# EAGLE design AS726x_Breakout (EAGLE 7.7.0)
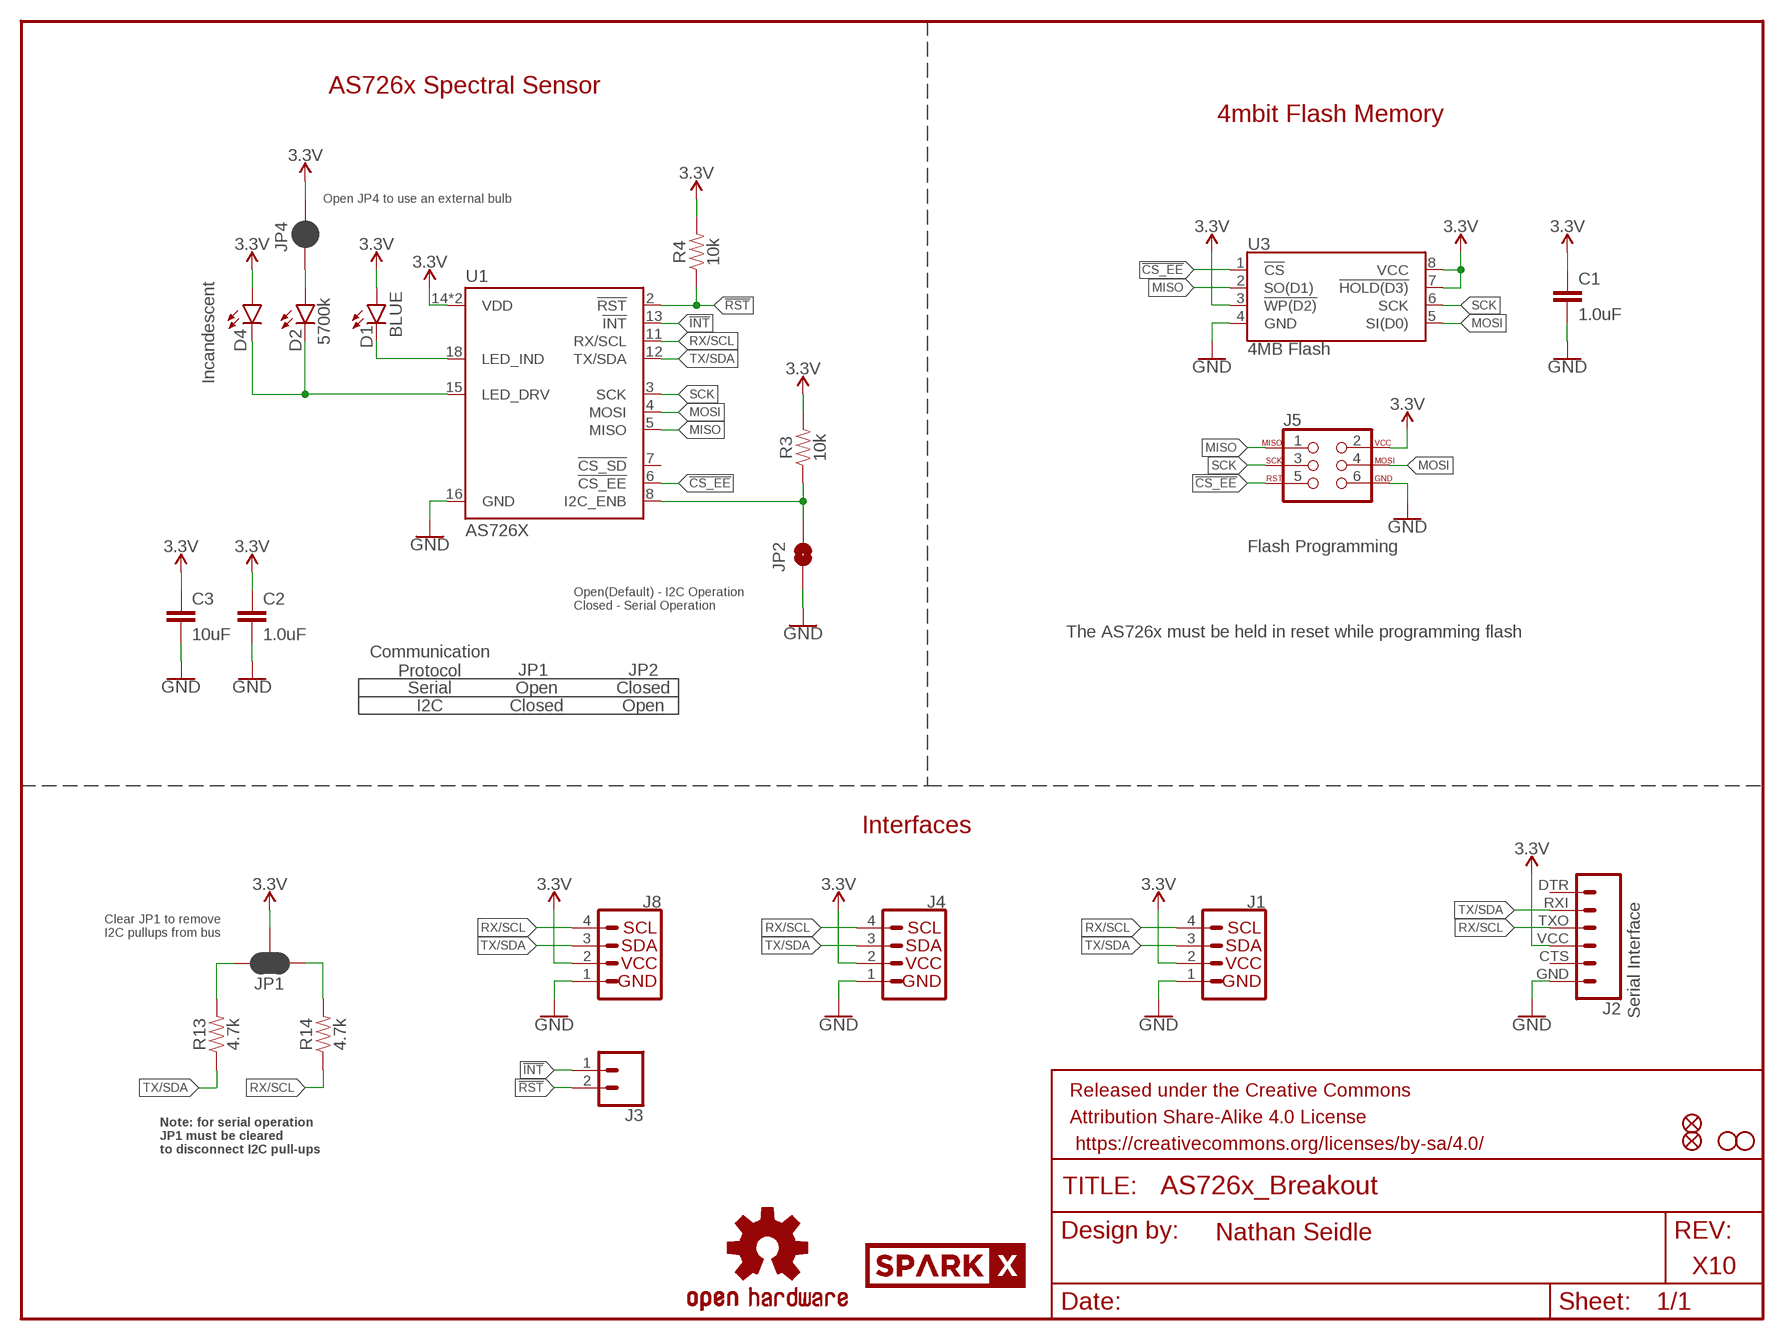
[diagram p0: schematic, sheet 1]

## Parts
C1  1.0uF  1.0UF-0603-16V-10%  [0603]
C2  1.0uF  1.0UF-0603-16V-10%  [0603]
C3  10uF  10UF-0603-6.3V-20%  [0603]
D1  BLUE  LED-BLUE0603  [LED-0603]
D2  5700k  LEDLD  [SUPER_BRIGHT_SMD_LED_1206]
D4  Incandescent  LEDNS  [LED_5MM_NOSILK]
FD1  FIDUCIAL1X2  [FIDUCIAL-1X2]
FD2  FIDUCIAL1X2  [FIDUCIAL-1X2]
FRAME1  FRAME-LETTER  [CREATIVE_COMMONS]
H2  STAND-OFF  [STAND-OFF]
H4  STAND-OFF  [STAND-OFF]
J1  I2C_STANDARDJS-1MM  [1X04_1MM_RA]
J2  Serial Interface  6_PIN_SERIAL_CABLEPTH  [FTDI_BASIC]
J3  CONN_021X02_NO_SILK  [1X02_NO_SILK]
J4  I2C_STANDARDJS-1MM  [1X04_1MM_RA]
J5  Flash Programming  AVR_SPI_PROG_3X2TESTPOINTS  [2X3_TEST_POINTS]
J8  I2C_STANDARD_NO_SILK  [1X04_NO_SILK]
JP1  JUMPER-SMT_3_2-NC_PASTE_SILK  [SMT-JUMPER_3_2-NC_PASTE_SILK]
JP2  JUMPER-SMT_2_NO_SILK  [SMT-JUMPER_2_NO_SILK]
JP4  JUMPER-SMT_2_NC_PASTE_NO-SILK  [SMT-JUMPER_2_NC_PASTE_NO-SILK]
LOGO4  OSHW-LOGOS  [OSHW-LOGO-S]
R3  10k  10KOHM-0603-1/10W-1%  [0603]
R4  10k  10KOHM-0603-1/10W-1%  [0603]
R13  4.7k  4.7KOHM-0603-1/10W-1%  [0603]
R14  4.7k  4.7KOHM-0603-1/10W-1%  [0603]
U1  AS726X  [LGA20]
U3  4MB Flash  AT25SF041  [SO08]
U$1  SPARKX-LOGO3  [SPARKX-SMALL]

## Nets
3.3V: C1.1 C2.1 C3.1 D1.A D4.A J1.2(VCC) J2.VCC J4.2(VCC) J5.2 J8.2 JP1.2 JP4.2 R3.2 R4.2 U1.14(VDD) U1.17(VDD) U3.3(!WP(D2)) U3.7(!HOLD(D3)) U3.8(VCC)
!CS_EE: J5.5 U1.6(!CS_EE) U3.1(!CS)
!INT: J3.1 U1.13(!INT)
!RST: J3.2 R4.1 U1.2(!RST)
GND: C1.2 C2.2 C3.2 J1.1(GND) J2.GND J4.1(GND) J5.6 J8.1 JP2.1 U1.16(GND) U3.4(GND)
LED_DRV: D2.C D4.K(C) U1.15(LED_DRV)
MISO: J5.1 U1.5(MISO) U3.2(SO(D1))
MOSI: J5.4 U1.4(MOSI) U3.5(SI(D0))
N$1: JP2.2 R3.1 U1.8(I2C_ENB)
N$2: D1.C U1.18(LED_IND)
N$4: JP1.3 R13.2
N$5: JP1.1 R14.2
N$6: D2.A JP4.1
RX/SCL: J1.4(SCL) J2.TXO J4.4(SCL) J8.4 R14.1 U1.11(RX/SCL)
SCK: J5.3 U1.3(SCK) U3.6(SCK)
TX/SDA: J1.3(SDA) J2.RXI J4.3(SDA) J8.3 R13.1 U1.12(TX/SDA)
Unconnected: J2.CTS J2.DTR U1.7(!CS_SD)

## Notes on the sheet
- AS726x Spectral Sensor
- 4mbit Flash Memory
- Open JP4 to use an external bulb
- Open(Default) - I2C Operation
  Closed - Serial Operation
- The AS726x must be held in reset while programming flash
- Communication
  Protocol
- JP1 | JP2
- Serial | Open | Closed
- I2C | Closed | Open
- Interfaces
- Clear JP1 to remove
  I2C pullups from bus
- Note: for serial operation
  JP1 must be cleared
  to disconnect I2C pull-ups
- Nathan Seidle
- X10

## Library data of the parts
C1 C2 = SparkFun-Capacitors:1.0UF: 1µF ceramic capacitors A capacitor is a passive two-terminal electrical component used to store electrical energy temporarily in an electric field.; PROD_ID: CAP-00868
C3 = SparkFun-Capacitors:10UF: 10.0µF ceramic capacitors A capacitor is a passive two-terminal electrical component used to store electrical energy temporarily in an electric field.; PROD_ID: CAP-11015
D1 = SparkFun-LED:LED-BLUE: Blue SMD LED Used in manufacturing of various products at SparkFun Packages: 0603 - SMD 0603 package [Product Link] <http://www.digikey.com/product-detail/en/SMLE12BC7TT86/511-1589-2-ND/1641808> 1206 - SMD1206 package [Product Link] <http://www.digikey.com/product-detail/en/lite-on-inc/LTST-C150TBKT/160-1643-1-ND/573584> SparkFun Products: ESP8266 Thing-Dev Board <https://www.sparkfun.com/products/13711> RedBoard <https://www.sparkfun.com/products/12757>; PROD_ID: DIO-08575
D2 D4 = SparkX:LED
FD1 FD2 = SparkFun-Aesthetics:FIDUCIAL: Fiducial Alignment Points Point-of-reference for pick-and-place machines and other optical instruments.
FRAME1 = SparkFun-Aesthetics:FRAME-LETTER: Schematic Frame - Letter Standard 8.5x11 US Letter frame
H2 H4 = SparkFun-Hardware:STAND-OFF: Stand Off Drill holes for mechanically mounting via screws, standoffs, etc. Note: Use the keepout ring to avoid running the screw head into surrounding components. Variant Overviews STAND-OFF - Mechanical footprint for a #4 phillips button head screw. STAND-OFF-TIGHT - Mechanical footprint for a #4 phillips button head screw, Example SparkFun Products Screw - Phillips Head (1/4", 4-40, 10 pack) <https://www.sparkfun.com/products/10453> (PRT-10453) Screw - Phillips Head (1/2", 4-40, 10 pack) <https://www.sparkfun.com/products/10452> (PRT-10452) Screw - Phillips Head (3/4", 4-40, 10 pack) <https://www.sparkfun.com/products/10451> (PRT-10451) Screw - Phillips Head (1", 4-40, 10 pack) <https://www.sparkfun.com/products/10450> (PRT-10450)
J1 J4 = SparkX:I2C_STANDARD: SparkFun I2C Standard Pinout Header SparkFun has standardized on a pinout for all I2C based sensor breakouts. This pinout allows I2C boards to be plugged directly into the headers on Arduino Uno compatible boards, and to be daisy chained easily. Example SparkFun Products: SparkFun Atmospheric Sensor Breakout - BME280 <https://www.sparkfun.com/products/13676> SparkFun Altitude/Pressure Sensor Breakout - MPL3115A2 <https://www.sparkfun.com/products/11084> SparkFun TOF Range Finder Sensor - VL6180 <https://www.sparkfun.com/products/12785>
J2 = SparkFun-Connectors:6_PIN_SERIAL_CABLE: 6-pin header connection for use with the "FTDI BASIC" pinout - CABLE SIDE. Also known as "Arduino Serial Program Header". This is used on a design to provide a 6-pin connection point for serial communication usually from a USB cable (D+/D-) to these headers (RX/TX). It also has the remaining pins necessary for programming in the Arduino evironment (DTR, GND, and sometimes VCC). Note, this device has "CABLE" in the name. It is intended to be used on a design that usually lives on the end of your USB cable and prvides the converter chip (FTDI232 or FTDI231x) to commnicate serial RX/TX. The "sister" device, named "TARGET" is inteneded to be used on a design that contains a target micro-controller that you wish to program. You can populate with some of these: Female Headers <https://www.sparkfun.com/products/115> (PRT-00115) For reference (or to suit your programming needs) check out these designs: SparkFun FTDI Basic Breakout - 5V <https://www.sparkfun.com/products/9716> (DEV-09716) SparkFun FTDI Basic Breakout - 3.3V <https://www.sparkfun.com/products/9873> (DEV-09873) SparkFun FTDI SmartBasic <https://www.sparkfun.com/products/12935> (DEV-12935) SparkFun Beefy 3 - FTDI Basic Breakout <https://www.sparkfun.com/products/13746> (DEV-13746)
J3 = SparkFun-Connectors:CONN_02: Multi connection point. Often used as Generic Header-pin footprint for 0.1 inch spaced/style header connections On any of the 0.1 inch spaced packages, you can populate with these: Break Away Headers - Straight <https://www.sparkfun.com/products/116> (PRT-00116) Break Away Male Headers - Right Angle <https://www.sparkfun.com/products/553> (PRT-00553) Female Headers <https://www.sparkfun.com/products/115> (PRT-00115) Break Away Headers - Machine Pin <https://www.sparkfun.com/products/117> (PRT-00117) Break Away Female Headers - Swiss Machine Pin <https://www.sparkfun.com/products/743> (PRT-00743) For SCREWTERMINALS and SPRING TERMINALS visit here: Screw Terimnals on SparkFun.com <https://www.sparkfun.com/search/results?term=Screw+Terminals> (5mm/3.5mm/2.54mm spacing) This device is also useful as a general connection point to wire up your design to another part of your project. Our various solder wires solder well into these plated through hole pads. Hook-Up Wire - Assortment (Stranded, 22 AWG) <https://www.sparkfun.com/products/11375> (PRT-11375) Hook-Up Wire - Assortment (Solid Core, 22 AWG) <https://www.sparkfun.com/products/11367> (PRT-11367) View the entire wire category on our website here <https://www.sparkfun.com/categories/141> Special notes: Molex polarized connector foot print use with: PRT-08233 with associated crimp pins and housings. 2.54_SCREWTERM for use with PRT-10571. 3.5mm Screw Terminal footprints for PRT-08084 5mm Screw Terminal footprints for use with PRT-08432
J5 = SparkFun-Connectors:AVR_SPI_PROG_3X2: AVR ISP 6 Pin This is the reduced ISP connector for AVR programming. Common on Arduino. This footprint will take up less PCB space and can be used with a 10-pin to 6-pin adapter such as SKU: BOB-08508 **Special note about "TEST_POINT" package. The stop mask is on the top side, so if you want your programming test points to be on the bottom of your board, make sure to place this package on the bottom side of the board. This also ensure that the orientation to program from the bottom side will be correct. SparkFun Products: SparkFun ISP Pogo Adapter <https://www.sparkfun.com/products/11591> - NS Tiny AVR Programmer <https://www.sparkfun.com/products/11801> -PTH
J8 = SparkFun-Connectors:I2C_STANDARD: SparkFun I2C Standard Pinout Header SparkFun has standardized on a pinout for all I2C based sensor breakouts. This pinout allows I2C boards to be plugged directly into the headers on Arduino Uno compatible boards, and to be daisy chained easily. Example SparkFun Products: SparkFun Atmospheric Sensor Breakout - BME280 <https://www.sparkfun.com/products/13676> SparkFun Altitude/Pressure Sensor Breakout - MPL3115A2 <https://www.sparkfun.com/products/11084> SparkFun TOF Range Finder Sensor - VL6180 <https://www.sparkfun.com/products/12785>
JP1 = SparkFun-Jumpers:JUMPER-SMT_3_2-NC_PASTE: Normally closed solder jumper (2 of 2 connections) This jumper has an aperture in the stencil to allow solder paste to bridge both connections. Both connections are normally closed (NC). Wick off the solder to open the connection(s). Reapply solder to reclose the connection(s).
JP2 = SparkFun-Jumpers:JUMPER-SMT_2_NO: Normally open jumper This jumper has two pads in close proximity to each other. Apply solder to close the connection. Round pads are easier to solder for beginners, but are a lot larger. SparkFun Product that uses the round pads: SparkFun EL Sequencer <https://www.sparkfun.com/products/12781>
JP4 = SparkFun-Jumpers:JUMPER-SMT_2_NC_PASTE: Normally closed solder jumper This jumper has an aperture in the stencil to allow solder paste to bridge the split in the wire so it's normally closed (NC). Wick off the solder to open the connection. Reapply solder to reclose the connection.
LOGO4 = SparkFun-Aesthetics:OSHW-LOGO: Open-Source Hardware (OSHW) Logo This logo indicates the piece of hardware it is found on incorporates a OSHW license and/or adheres to the definition of open source hardware found here: http://freedomdefined.org/OSHW
R3 R4 = SparkFun-Resistors:10KOHM: 10kΩ resistor A resistor is a passive two-terminal electrical component that implements electrical resistance as a circuit element. Resistors act to reduce current flow, and, at the same time, act to lower voltage levels within circuits. - Wikipedia; PROD_ID: RES-00824
R13 R14 = SparkFun-Resistors:4.7KOHM: 4.7kΩ resistor A resistor is a passive two-terminal electrical component that implements electrical resistance as a circuit element. Resistors act to reduce current flow, and, at the same time, act to lower voltage levels within circuits. - Wikipedia; PROD_ID: RES-07857
U1 = SparkX:AS726X
U3 = SparkFun-IC-Memory:AT25SF041: AT25SF041 4Mb Serial Flash Memory 104MHz, SPI, 8-SOIC Datasheet <http://www.adestotech.com/wp-content/uploads/DS-AT25SF041_044.pdf> SparkFun Products: SparkFun ESP8266 Thing <https://www.sparkfun.com/products/13231> SparkFun ESP8266 Thing - Dev Board <https://www.sparkfun.com/products/13711>; PROD_ID: IC-12455
U$1 = SparkX:SPARKX-LOGO

## Board
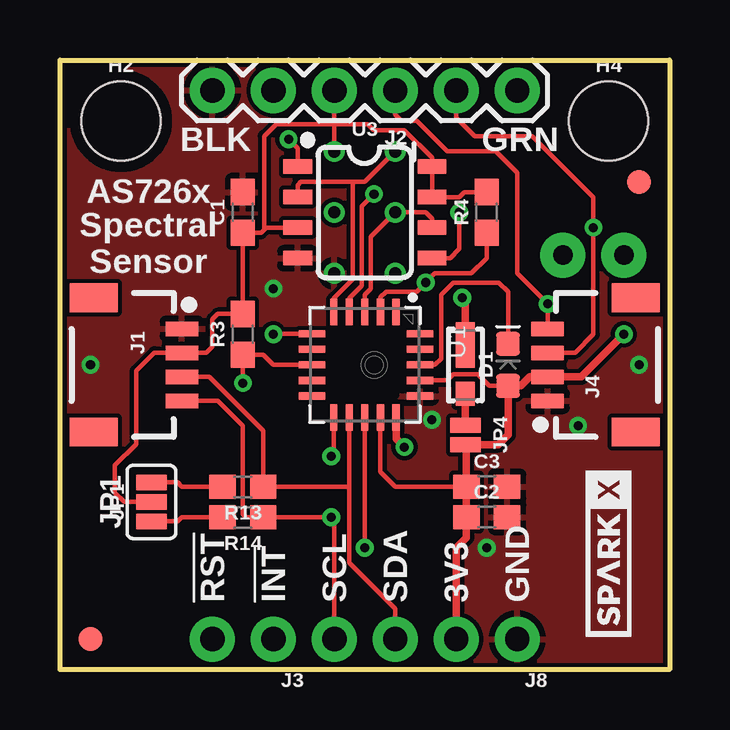
[diagram p1: board, top side]
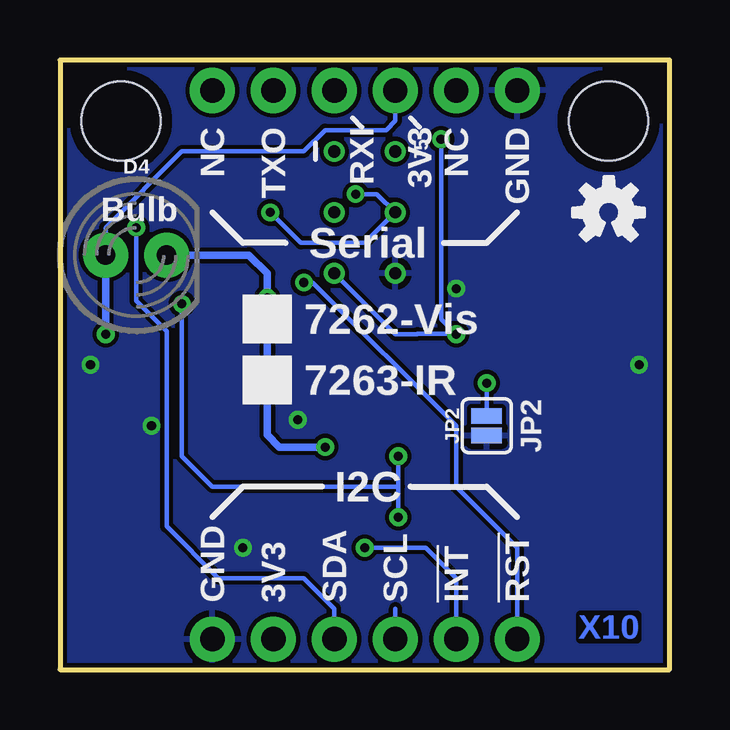
[diagram p2: board, bottom side, seen from below]

Size 25.4 x 25.4 mm. Coordinates in mm from the lower left corner, seen from the top.
Outline: 0,0 0,25.4 25.4,25.4 25.4,0 0,0
Copper layers (1*16): Top 0.035mm / dielectric 1.5mm / Bottom 0.035mm
Design rules "SparkFun-2-layer-TIGHT": minimum track width 7mil, minimum drill 15mil, track to track 7mil, track to pad 7mil, pad to pad 7mil, via to via 7mil, smd to smd 7mil, copper to edge 7mil, drill to drill 7mil, minimum pad ring 7mil, minimum via ring 7mil, stop-mask expansion 4mil, vias tented up to drill 25mil, thermal gap 10mil

### Footprints (pad centres in the part's own frame; a part is rotated, then mirrored left to right if it is on the bottom)
0603 = smd 1.1 x 1: 1 -0.85,0; 2 0.85,0
LED-0603 = smd 1 x 1: A -0.877,0; C 0.877,0
SUPER_BRIGHT_SMD_LED_1206 = smd 1 x 0.8: A -1.2,0 | smd 1.9 x 0.8: C 0.827,0
LED_5MM_NOSILK = drill 0.813 pad 1.88: A -1.27,0; K 1.27,0
FIDUCIAL-1X2 = smd 1 x 1: 1 0,0
STAND-OFF = hole 3.302: 0,0
1X04_1MM_RA = smd 0.6 x 1.35: 1 -1.5,0; 2 -0.5,0; 3 0.5,0; 4 1.5,0 | smd 1.2 x 2: NC1 2.8,-3.675; NC2 -2.8,-3.675
FTDI_BASIC = drill 1.016 pad 1.88: CTS 10.16,0; DTR 0,0; GND 12.7,0; RXI 2.54,0; TXO 5.08,0; VCC 7.62,0
1X02_NO_SILK = drill 1.016 pad 1.88: 1 0,0; 2 2.54,0
2X3_TEST_POINTS = drill 0.508: 1 -2.54,-1.27; 2 -2.54,1.27; 3 0,-1.27; 4 0,1.27; 5 2.54,-1.27; 6 2.54,1.27
1X04_NO_SILK = drill 1.016 pad 1.88: 1 0,0; 2 2.54,0; 3 5.08,0; 4 7.62,0
SMT-JUMPER_3_2-NC_PASTE_SILK = smd 0.635 x 1.27: 1 -0.813,0; 2 0,0; 3 0.813,0
SMT-JUMPER_2_NO_SILK = smd 0.635 x 1.27: 1 -0.406,0; 2 0.406,0
SMT-JUMPER_2_NC_PASTE_NO-SILK = smd 0.635 x 1.27: 1 -0.406,0; 2 0.406,0
LGA20 = smd 1.1 x 0.3: 1 -2.2,1.3; 2 -2.2,0.65; 3 -2.2,0; 4 -2.2,-0.65; 5 -2.2,-1.3; 11 2.2,-1.3; 12 2.2,-0.65; 13 2.2,0; 14 2.2,0.65; 15 2.2,1.3 | smd 0.3 x 1.1: 6 -1.3,-2.2; 7 -0.65,-2.2; 8 0,-2.2; 9 0.65,-2.2; 10 1.3,-2.2; 16 1.3,2.3; 17 0.65,2.3; 18 0,2.3; 19 -0.65,2.3; 20 -1.3,2.3
SO08 = smd 0.6 x 1.2: 1 -1.905,-2.8; 2 -0.635,-2.8; 3 0.635,-2.8; 4 1.905,-2.8; 5 1.905,2.8; 6 0.635,2.8; 7 -0.635,2.8; 8 -1.905,2.8

### Placement (x,y rotation side)
C1  7.62,19.05 90 top
C2  17.78,6.35 0 top
C3  17.78,7.62 0 top
D1  18.67,12.7 90 top
D2  16.89,12.7 90 top
D4  22.23,17.27 0 bottom
FD1  1.27,1.27 0 top
FD2  24.13,20.32 0 top
FRAME1  -13.97,-21.59 0 top  (outside the outline)
H2  2.54,22.86 0 top
H4  22.86,22.86 0 top
J1  5.08,12.7 270 top
J2  19.05,24.13 180 top
J3  8.89,1.27 180 top
J4  20.32,12.7 90 top
J5  12.7,19.05 270 bottom
J8  19.05,1.27 180 top
JP1  3.81,6.99 90 top
JP2  7.62,10.16 90 bottom
JP4  16.89,9.78 270 top
LOGO4  2.54,19.05 0 bottom
R3  7.62,13.97 90 top
R4  17.78,19.05 90 top
R13  7.62,7.62 180 top
R14  7.62,6.35 180 top
U1  12.7,12.7 270 top
U3  12.7,19.05 270 top
U$1  22.86,4.83 90 top

### Tracks (layer width: path | path; a pad name or v marks a point on that pad's centre or on a via)
3.3V  (via drill 0.38)
  Top 0.178: C3.1 13.97,7.62 13.35,8.24 U1.14 | U3.3 8.6,18.41 8.51,18.33 | R4.2 16.85,19.9 16.64,19.68 U3.7 U3.8 15.5,21.33 14.35,22.48 13.08,22.48 12.83,22.73 11.43,22.73 | 8.51,18.33 8.51,22.23 9.02,22.73 11.43,22.73 | 8.51,18.33 8.38,18.2 C1.1 R3.2 6.57,14.82 6.35,14.61 6.35,13.46 6.09,13.2 J1.2 3.94,13.21 3.17,12.45 3.17,9.4 2.29,8.51 2.29,7.37 2.67,6.99 JP1.2 | J2.VCC 11.43,22.73 | 11.43,22.73 J5.2 | J4.2 | U1.17 16.13,12.05 16.38,12.31 17.4,12.31 17.88,11.82 D1.A
  Top 0.305: J8.2 16.51,5.08 16.93,5.5 C2.1 C3.1 16.93,9.33 JP4.2 18.26,9.37 18.67,9.78 D1.A 19.19,11.82 19.57,12.2 J4.2 21.73,12.2 v23.5,13.97
  Bottom 0.178: D4.A 23.5,18.41 20.32,21.59 15.24,21.59 14.35,22.48 11.81,22.48 11.43,22.86 J2.VCC
  Bottom 0.305: v23.5,13.97 D4.A
!CS_EE  (via drill 0.38)
  Top 0.178: U3.1 9.9,21.72 v9.53,22.1 | U1.6 8.92,14 v8.89,13.97
  Bottom 0.178: v9.53,22.1 9.53,14.61 v8.89,13.97 8.92,14 U1.6 10.53,13.97 11.43,13.97 J5.5
!INT  (via drill 0.38)
  Top 0.178: U1.13 v12.7,5.08
  Bottom 0.178: J3.1 8.89,3.81 10.16,5.08 v12.7,5.08
!RST  (via drill 0.38)
  Top 0.178: U1.2 13.35,15.51 13.59,15.75 14.86,15.75 v15.24,16.13 15.62,16.51 17.14,16.51 17.78,17.14 R4.1
  Bottom 0.178: v15.24,16.13 14.86,16.13 8.89,10.16 8.89,7.62 6.35,5.08 J3.2
GND  (via drill 0.38)
  other vias: 15.49,10.41 8.89,15.88 1.27,12.7 24.13,12.7 21.59,10.16 17.78,5.08
  pour Top (isolate 0.178): 0,0 25.4,0 25.4,25.4 0,25.4
  pour Bottom (isolate 0.178): 0,25.4 25.4,25.4 25.4,0 0,0
LED_DRV  (via drill 0.38)
  Top 0.305: U1.15 14,9.62 v14.35,9.27 | D2.C 16.89,15.37 v16.76,15.49
  Bottom 0.305: v14.35,9.27 16.26,9.27 16.76,9.78 v16.76,15.49 16.76,16.51 17.53,17.27 D4.K
MISO
  Top 0.178: 12.19,20.32 12.19,16.26 11.4,15.46 U1.5 | U3.2 9.9,20.19 10.03,20.32 12.19,20.32 | 12.19,20.32 12.7,20.32 J5.1
MOSI  (via drill 0.38)
  Top 0.178: U1.4 12.05,15.48 12.57,16 12.57,19.3 v13.08,19.81 | U3.5 16.26,17.14 16.64,17.53 v16.64,19.05
  Bottom 0.178: v13.08,19.81 12.19,19.81 J5.4 12.7,17.78 15.37,17.78 v16.64,19.05
N$1  (via drill 0.38)
  Top 0.178: U1.8 8.89,12.7 8.47,13.12 R3.1 v7.62,11.94
  Bottom 0.178: v7.62,11.94 JP2.2
N$2
  Top 0.178: U1.18 15.62,12.7 15.88,12.95 15.88,15.62 16.38,16.13 18.29,16.13 18.67,15.75 D1.C
N$4
  Top 0.178: R13.2 5.08,7.62 4.9,7.8 JP1.3
N$5
  Top 0.178: R14.2 5.08,6.35 4.9,6.17 JP1.1
N$6
  Top 0.305: JP4.1 D2.A
RX/SCL  (via drill 0.38)
  Top 0.178: J4.4 v20.32,15.24 19.05,16.51 19.05,20.7 18.16,21.59 16.13,21.59 14.86,22.86 14.22,22.86 13.97,23.11 J2.TXO | J1.4 6.58,11.2 7.62,10.16 7.62,6.48 7.75,6.35 R14.1 v11.3,6.35 11.43,6.22 J8.4 | U1.11 11.4,8.99 v11.3,8.89
  Bottom 0.178: 11.3,7.62 19.05,7.62 20.32,8.89 v20.32,15.24 | J8.4 11.43,2.54 | v11.3,6.35 11.3,7.62 | 11.3,7.62 v11.3,8.89
SCK
  Top 0.178: U1.3 12.7,15.62 12.95,15.88 12.95,18.03 J5.3 15.24,19.05 15.5,18.79 U3.6
TX/SDA  (via drill 0.38)
  Top 0.178: U1.12 12.05,7.62 | 12.05,7.62 12.05,4.46 13.97,2.54 J8.3 | J2.RXI 16.51,22.99 17.27,22.23 19.68,22.23 22.23,19.68 v22.23,18.41 22.23,13.97 21.46,13.21 J4.3 | 12.05,7.62 R13.1 8.47,9.95 6.21,12.2 J1.3
  Bottom 0.178: J8.3 13.97,2.54 15.24,3.81 18.8,3.81 20.95,5.97 20.95,14.1 22.23,15.37 v22.23,18.41

### Text on the board
Bottom: X10
tPlace: BLK | GRN | AS726x | Spectral / Sensor | JP1 | !RST | !INT | SCL | SDA | 3V3 | GND
bPlace: GND | NC | 3V3 | RXI | TXO | NC | Bulb | Serial | 7262-Vis | 7263-IR | JP2 | I2C | !RST | !INT | SCL | SDA | 3V3 | GND
tDocu: Nathan Seidle